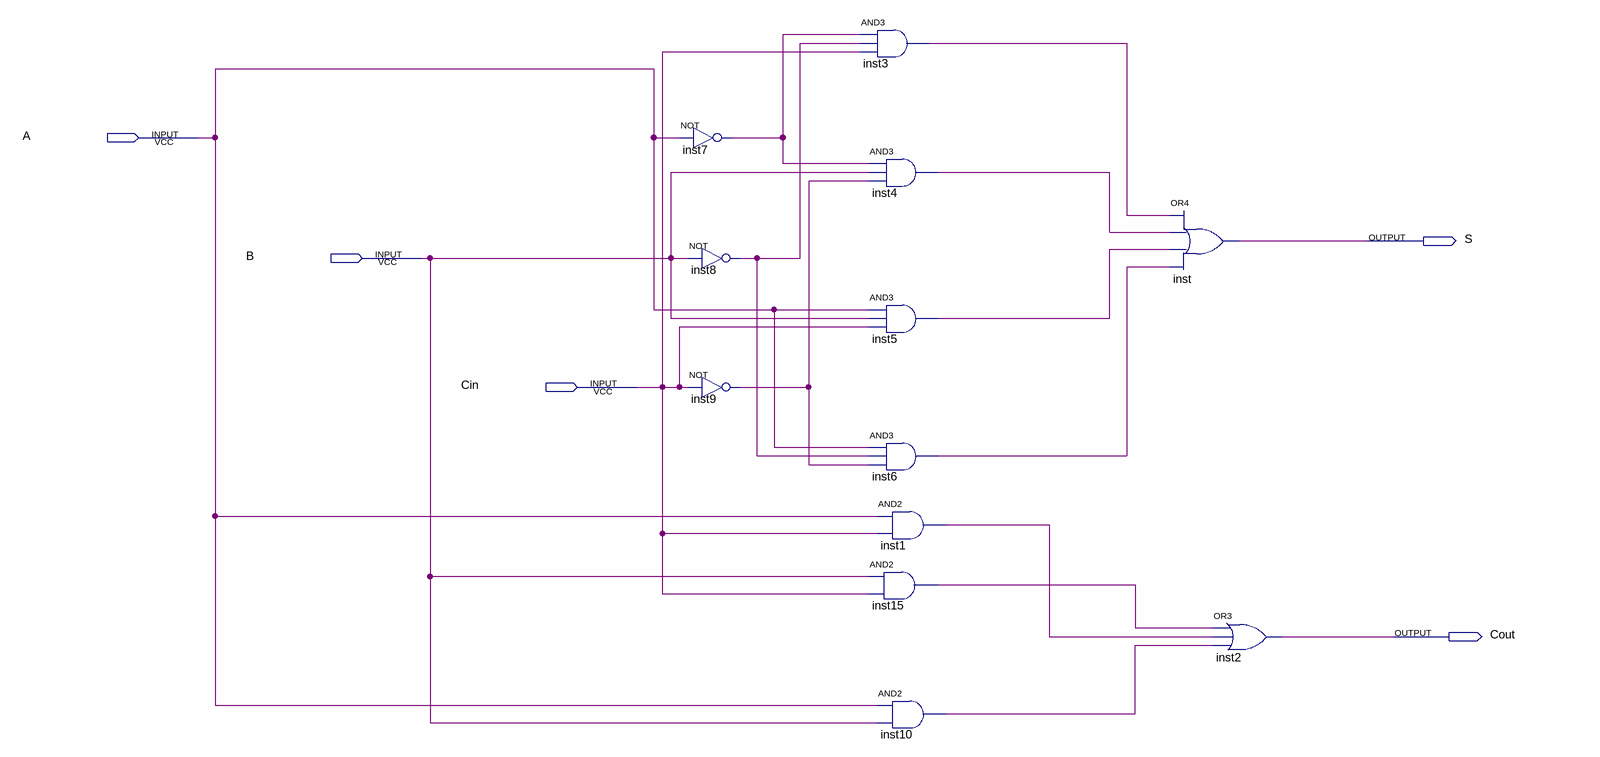
[diagram p0: schematic sheet]
// Quartus schematic A.bdf as structural Verilog: 12 symbols, 5 pins
module A (
  input  A,
  input  B,
  input  Cin,
  output S,
  output Cout
);

  wire inst1_out, inst3_out, inst4_out, inst5_out, inst6_out, inst7_out, inst8_out, inst9_out, inst10_out,
       inst15_out;

  not inst7 (inst7_out, A);
  not inst8 (inst8_out, B);
  not inst9 (inst9_out, Cin);
  and inst3 (inst3_out, inst7_out, inst8_out, Cin);
  and inst4 (inst4_out, inst7_out, B, inst9_out);
  and inst5 (inst5_out, A, B, Cin);
  and inst6 (inst6_out, A, inst8_out, inst9_out);
  and inst15 (inst15_out, B, Cin);
  and inst1 (inst1_out, A, Cin);
  and inst10 (inst10_out, A, B);
  or inst (S, inst3_out, inst4_out, inst5_out, inst6_out);
  or inst2 (Cout, inst15_out, inst1_out, inst10_out);
endmodule
